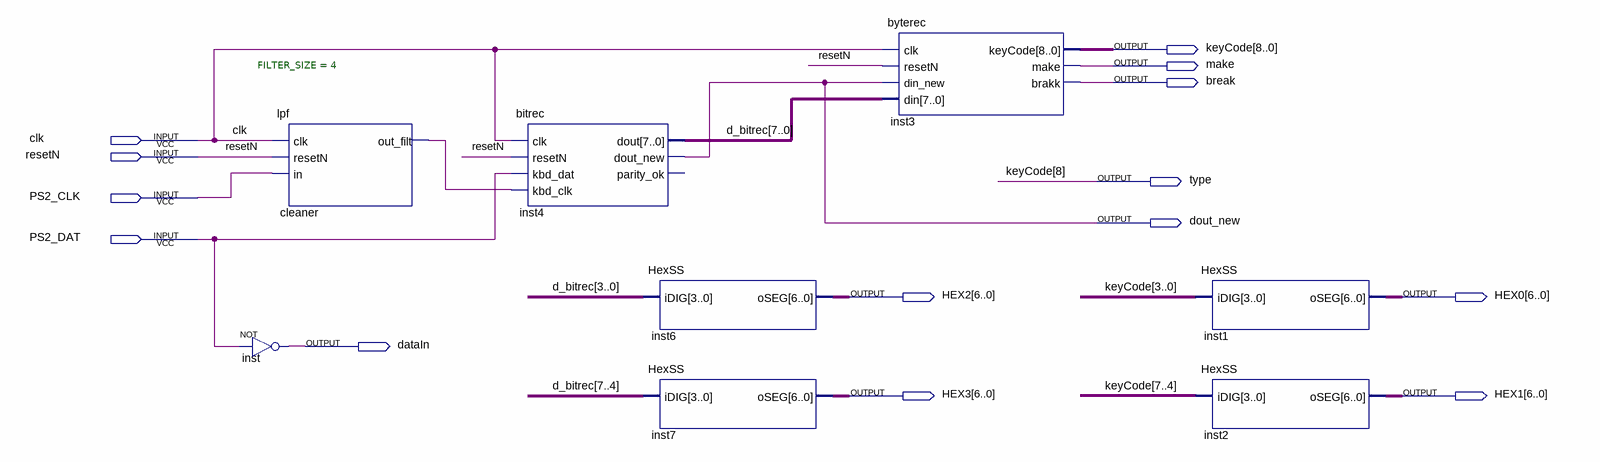
[diagram p0: schematic sheet]
// Quartus schematic TOP_KBDINTF.bdf as structural Verilog: 8 symbols, 14 pins
module TOP_KBDINTF (
  input  clk,
  input  resetN,
  input  PS2_CLK,
  input  PS2_DAT,
  output [8:0] keyCode,
  output make,
  output \break ,
  output \type ,
  output dout_new,
  output [6:0] HEX2,
  output [6:0] HEX0,
  output dataIn,
  output [6:0] HEX3,
  output [6:0] HEX1
);

  wire cleaner_out_filt;
  wire [7:0] d_bitrec;

  lpf #(.FILTER_SIZE(4)) cleaner (.clk(clk), .resetN(resetN), .in(PS2_CLK), .out_filt(cleaner_out_filt));
  not inst (dataIn, PS2_DAT);
  bitrec inst4 (
    .clk(clk), .resetN(resetN), .kbd_dat(PS2_DAT), .kbd_clk(cleaner_out_filt), .dout(d_bitrec),
    .dout_new(dout_new));  // open: parity_ok
  HexSS inst6 (.iDIG(d_bitrec[3:0]), .oSEG(HEX2));
  HexSS inst7 (.iDIG(d_bitrec[7:4]), .oSEG(HEX3));
  byterec inst3 (
    .clk(clk), .resetN(resetN), .din_new(dout_new), .din(d_bitrec), .keyCode(keyCode), .make(make),
    .brakk(\break ));
  HexSS inst1 (.iDIG(keyCode[3:0]), .oSEG(HEX0));
  HexSS inst2 (.iDIG(keyCode[7:4]), .oSEG(HEX1));

  assign \type  = keyCode[8];
endmodule
